# Altium schematic sheet Main schem.SchDoc
size A3
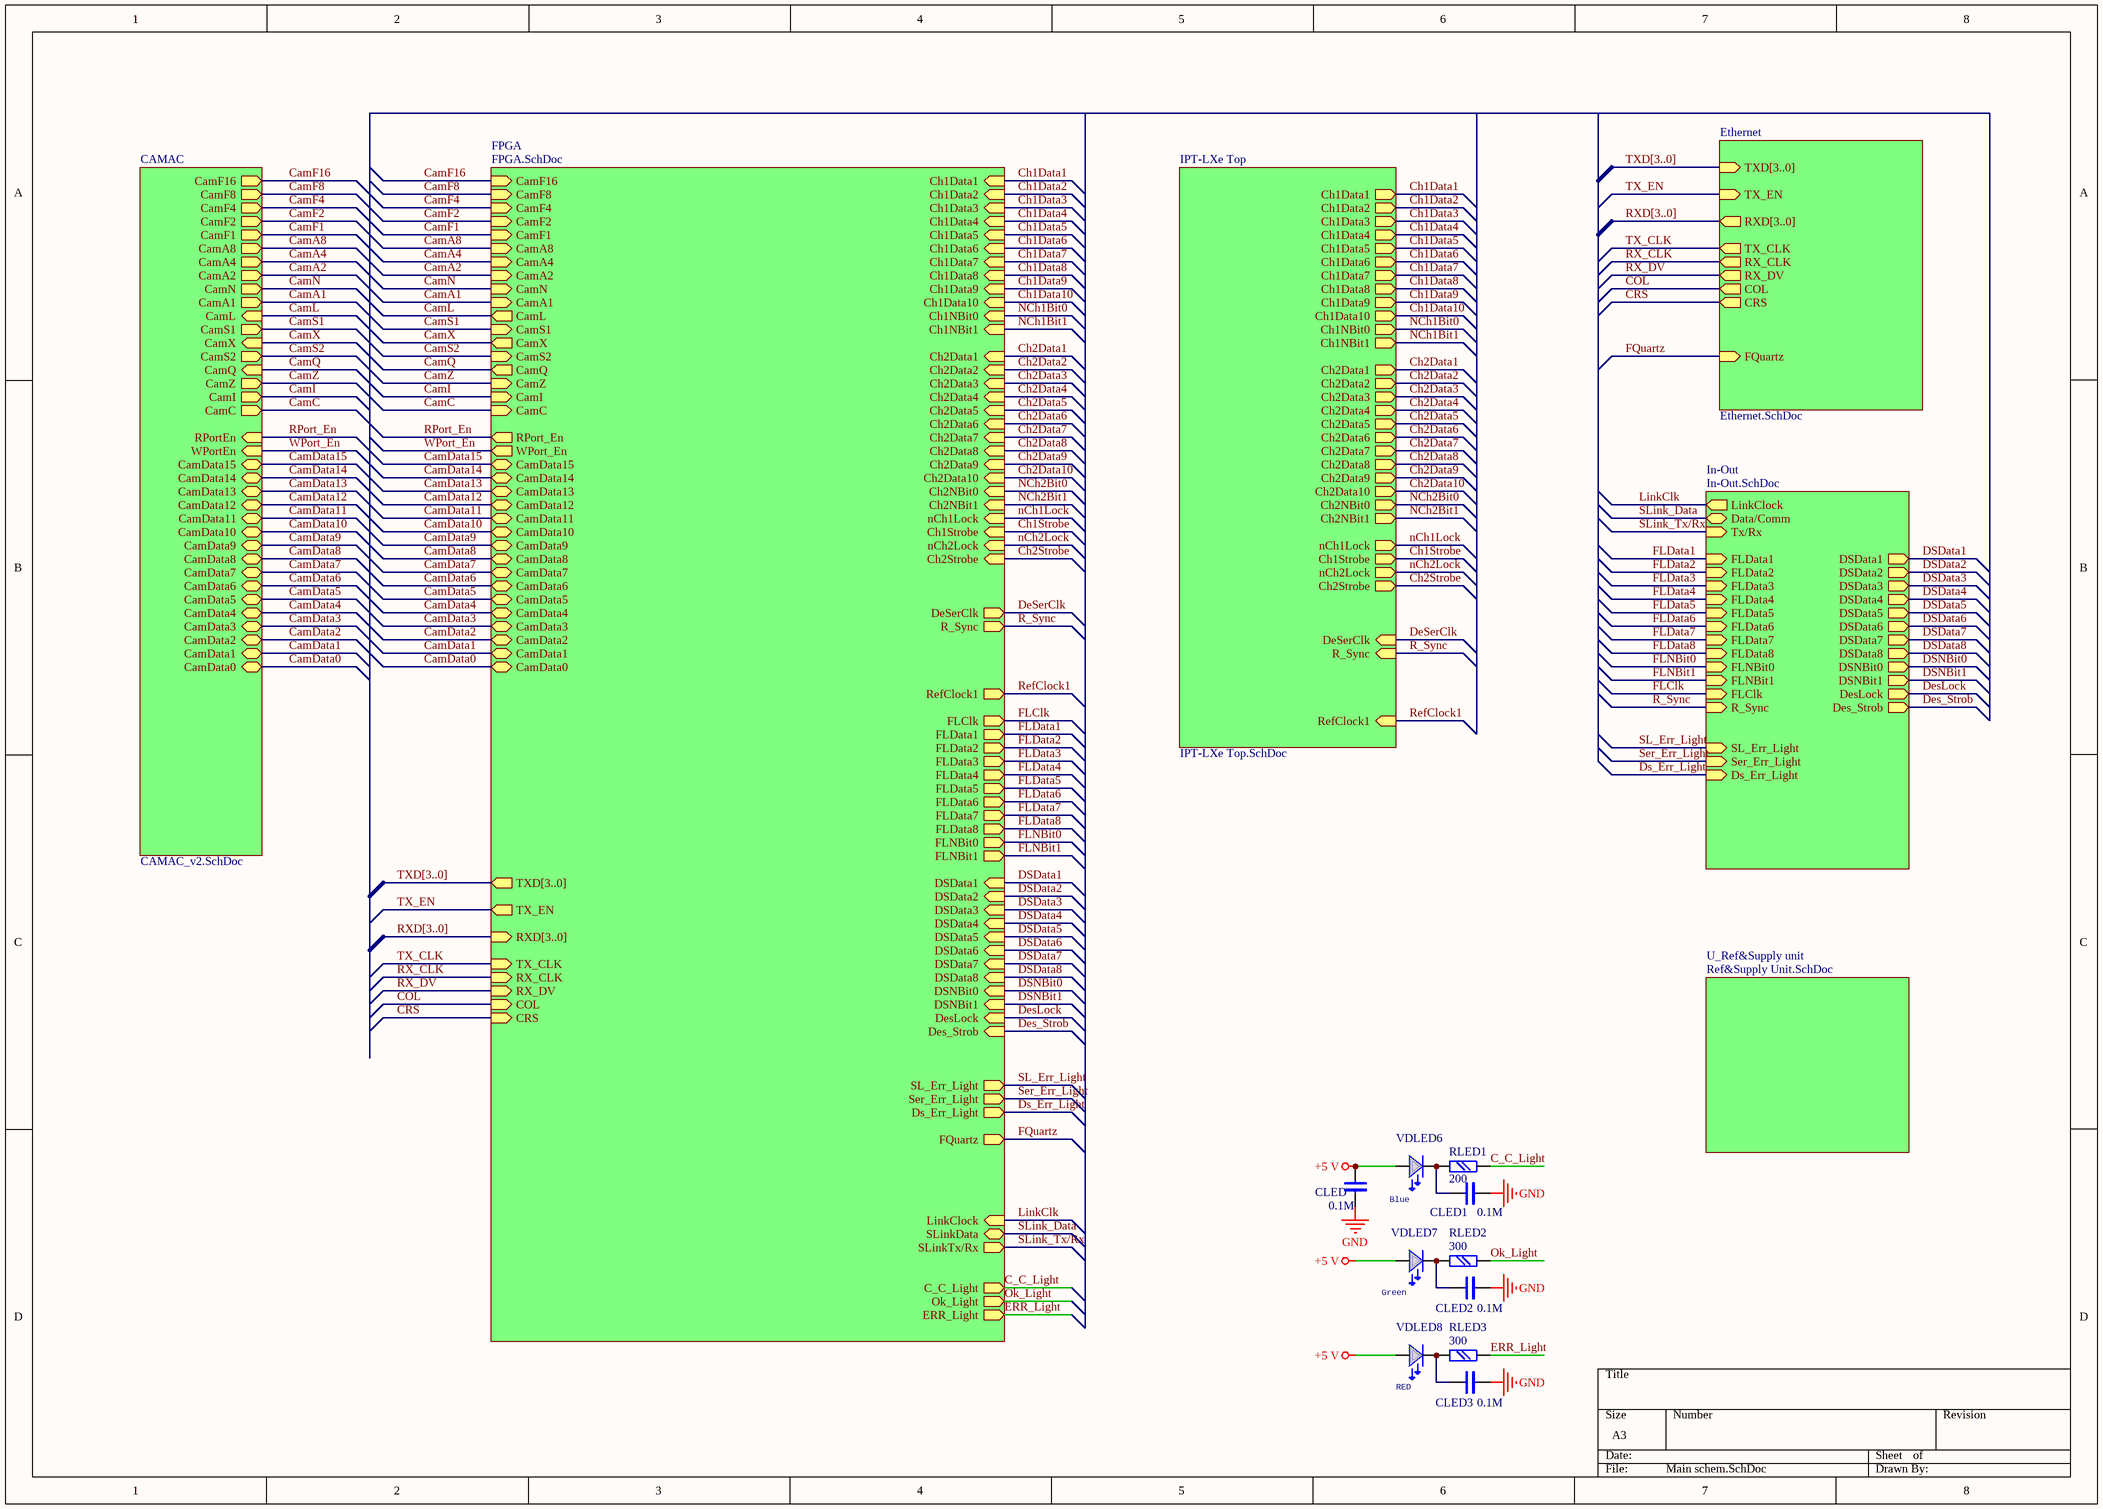
[diagram p0: Main schem.SchDoc]

## Parts
CLED  0.1M  [chip0805]
CLED1  0.1M  [chip0805]
CLED2  0.1M  [chip0805]
CLED3  0.1M  [chip0805]
RLED1  200  [chip0805]
RLED2  300  [chip0805]
RLED3  300  [chip0805]
VDLED6  LED  [LED2P5_H]  (value not drawn)
VDLED7  LED  [LED2P5_H]  (value not drawn)
VDLED8  LED  [LED2P5_H]  (value not drawn)

## Sub-sheets
CAMAC = CAMAC_v2.SchDoc: CamF1 (out), CamF2 (out), CamF4 (out), CamF8 (out), CamF16 (out), CamA8 (out), CamA4 (out), CamA2 (out), CamA1 (out), CamN (out), CamS1 (out), CamS2 (out), CamL (in), CamX (in), CamQ (in), CamData1 (bidir), CamData2 (bidir), CamData3 (bidir), CamData4 (bidir), CamData5 (bidir), CamData6 (bidir), CamData7 (bidir), CamData8 (bidir), CamData9 (bidir), CamData10 (bidir), CamData11 (bidir), CamData12 (bidir), CamData13 (bidir), CamData14 (bidir), CamData15 (bidir), CamData0 (bidir), CamI (out), CamZ (out), CamC (out), WPortEn (in), RPortEn (in)
Ethernet = Ethernet.SchDoc: COL (out), TX_EN (in), TX_CLK (out), RX_CLK (out), RX_DV (out), TXD[3..0] (in), RXD[3..0] (out), CRS (out), FQuartz (in)
FPGA = FPGA.SchDoc: ERR_Light (out), Ok_Light (out), C_C_Light (out), SLinkData (bidir), SLinkTx/Rx (out), Ch1Data1 (in), Ch1Data2 (in), Ch1Data3 (in), Ch1Data4 (in), Ch1Data5 (in), Ch1Data6 (in), Ch1Data7 (in), Ch1Data8 (in), Ch1NBit0 (in), Ch1NBit1 (in), Ch1Data9 (in), Ch1Data10 (in), LinkClock (in), CamF1 (in), CamF2 (in), CamF4 (in), CamF8 (in), CamF16 (in), CamA8 (in), CamA4 (in), CamA2 (in), CamA1 (in), CamN (in), CamS1 (in), CamS2 (in), CamL (out), CamX (out), CamQ (out), Ch2Data1 (in), Ch2Data2 (in), Ch2Data3 (in), Ch2Data4 (in), Ch2Data5 (in), Ch2Data6 (in), Ch2Data7 (in), Ch2Data8 (in), Ch2NBit0 (in), Ch2NBit1 (in), DeSerClk (out), R_Sync (out), Ch2Data9 (in), Ch2Data10 (in), nCh2Lock (in), Ch2Strobe (in), nCh1Lock (in), Ch1Strobe (in), RefClock1 (out), CamData1 (bidir), CamData2 (bidir), CamData3 (bidir), CamData4 (bidir), CamData5 (bidir), CamData6 (bidir), CamData7 (bidir), CamData8 (bidir), CamData9 (bidir), CamData10 (bidir), CamData11 (bidir), CamData12 (bidir), CamData13 (bidir), CamData14 (bidir), CamData15 (bidir), CamData0 (bidir), FLData1 (out), FLData2 (out), FLData3 (out), FLData4 (out), FLData5 (out), FLData6 (out), FLData7 (out), FLData8 (out), FLNBit0 (out), FLNBit1 (out), DSData1 (in), DSData2 (in), DSData3 (in), DSData4 (in), DSData5 (in), DSData6 (in), DSData7 (in), DSData8 (in), DSNBit0 (in), DSNBit1 (in), DesLock (in), Des_Strob (in), CamI (in), CamZ (in), CamC (in), Ser_Err_Light (out), Ds_Err_Light (out), FQuartz (out), SL_Err_Light (out), COL (in), TX_EN (out), TX_CLK (in), RX_CLK (in), RX_DV (in), TXD[3..0] (out), CRS (in), RXD[3..0] (in), WPort_En (out), RPort_En (out), FLClk (out)
In-Out = In-Out.SchDoc: Tx/Rx (in), Data/Comm (bidir), LinkClock (out), FLData1 (in), FLData2 (in), FLData3 (in), FLData4 (in), FLData5 (in), FLData6 (in), FLData7 (in), FLData8 (in), FLNBit0 (in), FLNBit1 (in), FLClk (in), R_Sync (in), DSData1 (out), DSData2 (out), DSData3 (out), DSData4 (out), DSData5 (out), DSData6 (out), DSData7 (out), DSData8 (out), DSNBit0 (out), DSNBit1 (out), DesLock (out), Des_Strob (out), Ser_Err_Light (in), Ds_Err_Light (in), SL_Err_Light (in)
IPT-LXe Top = IPT-LXe Top.SchDoc: RefClock1 (in), Ch1Data1 (out), Ch1Data2 (out), Ch1Data3 (out), Ch1Data4 (out), Ch1Data5 (out), Ch1Data6 (out), Ch1Data7 (out), Ch1Data8 (out), Ch1NBit0 (out), Ch1NBit1 (out), Ch1Data9 (out), Ch1Data10 (out), Ch2Data1 (out), Ch2Data2 (out), Ch2Data3 (out), Ch2Data4 (out), Ch2Data5 (out), Ch2Data6 (out), Ch2Data7 (out), Ch2Data8 (out), Ch2NBit0 (out), Ch2NBit1 (out), Ch2Data9 (out), Ch2Data10 (out), DeSerClk (in), R_Sync (in), nCh2Lock (out), Ch2Strobe (out), nCh1Lock (out), Ch1Strobe (out)
U_Ref&Supply unit = Ref&Supply Unit.SchDoc: no entries

## Nets
+5 V: CLED.1 VDLED6.ANOD VDLED7.ANOD VDLED8.ANOD
GND: CLED.2 CLED1.2 CLED2.2 CLED3.2
C_C_Light: RLED1.2 ; sheet FPGA/C_C_Light
CamA1: sheet CAMAC/CamA1, sheet FPGA/CamA1
CamA2: sheet CAMAC/CamA2, sheet FPGA/CamA2
CamA4: sheet CAMAC/CamA4, sheet FPGA/CamA4
CamA8: sheet CAMAC/CamA8, sheet FPGA/CamA8
CamC: sheet CAMAC/CamC, sheet FPGA/CamC
CamData0: sheet CAMAC/CamData0, sheet FPGA/CamData0
CamData1: sheet CAMAC/CamData1, sheet FPGA/CamData1
CamData2: sheet CAMAC/CamData2, sheet FPGA/CamData2
CamData3: sheet CAMAC/CamData3, sheet FPGA/CamData3
CamData4: sheet CAMAC/CamData4, sheet FPGA/CamData4
CamData5: sheet CAMAC/CamData5, sheet FPGA/CamData5
CamData6: sheet CAMAC/CamData6, sheet FPGA/CamData6
CamData7: sheet CAMAC/CamData7, sheet FPGA/CamData7
CamData8: sheet CAMAC/CamData8, sheet FPGA/CamData8
CamData9: sheet CAMAC/CamData9, sheet FPGA/CamData9
CamData10: sheet CAMAC/CamData10, sheet FPGA/CamData10
CamData11: sheet CAMAC/CamData11, sheet FPGA/CamData11
CamData12: sheet CAMAC/CamData12, sheet FPGA/CamData12
CamData13: sheet CAMAC/CamData13, sheet FPGA/CamData13
CamData14: sheet CAMAC/CamData14, sheet FPGA/CamData14
CamData15: sheet CAMAC/CamData15, sheet FPGA/CamData15
CamF1: sheet CAMAC/CamF1, sheet FPGA/CamF1
CamF2: sheet CAMAC/CamF2, sheet FPGA/CamF2
CamF4: sheet CAMAC/CamF4, sheet FPGA/CamF4
CamF8: sheet CAMAC/CamF8, sheet FPGA/CamF8
CamF16: sheet CAMAC/CamF16, sheet FPGA/CamF16
CamI: sheet CAMAC/CamI, sheet FPGA/CamI
CamL: sheet CAMAC/CamL, sheet FPGA/CamL
CamN: sheet CAMAC/CamN, sheet FPGA/CamN
CamQ: sheet CAMAC/CamQ, sheet FPGA/CamQ
CamS1: sheet CAMAC/CamS1, sheet FPGA/CamS1
CamS2: sheet CAMAC/CamS2, sheet FPGA/CamS2
CamX: sheet CAMAC/CamX, sheet FPGA/CamX
CamZ: sheet CAMAC/CamZ, sheet FPGA/CamZ
Ch1Data1: sheet IPT-LXe Top/Ch1Data1, sheet FPGA/Ch1Data1
Ch1Data2: sheet IPT-LXe Top/Ch1Data2, sheet FPGA/Ch1Data2
Ch1Data3: sheet IPT-LXe Top/Ch1Data3, sheet FPGA/Ch1Data3
Ch1Data4: sheet IPT-LXe Top/Ch1Data4, sheet FPGA/Ch1Data4
Ch1Data5: sheet IPT-LXe Top/Ch1Data5, sheet FPGA/Ch1Data5
Ch1Data6: sheet IPT-LXe Top/Ch1Data6, sheet FPGA/Ch1Data6
Ch1Data7: sheet IPT-LXe Top/Ch1Data7, sheet FPGA/Ch1Data7
Ch1Data8: sheet IPT-LXe Top/Ch1Data8, sheet FPGA/Ch1Data8
Ch1Data9: sheet IPT-LXe Top/Ch1Data9, sheet FPGA/Ch1Data9
Ch1Data10: sheet IPT-LXe Top/Ch1Data10, sheet FPGA/Ch1Data10
Ch1Strobe: sheet IPT-LXe Top/Ch1Strobe, sheet FPGA/Ch1Strobe
Ch2Data1: sheet IPT-LXe Top/Ch2Data1, sheet FPGA/Ch2Data1
Ch2Data2: sheet IPT-LXe Top/Ch2Data2, sheet FPGA/Ch2Data2
Ch2Data3: sheet IPT-LXe Top/Ch2Data3, sheet FPGA/Ch2Data3
Ch2Data4: sheet IPT-LXe Top/Ch2Data4, sheet FPGA/Ch2Data4
Ch2Data5: sheet IPT-LXe Top/Ch2Data5, sheet FPGA/Ch2Data5
Ch2Data6: sheet IPT-LXe Top/Ch2Data6, sheet FPGA/Ch2Data6
Ch2Data7: sheet IPT-LXe Top/Ch2Data7, sheet FPGA/Ch2Data7
Ch2Data8: sheet IPT-LXe Top/Ch2Data8, sheet FPGA/Ch2Data8
Ch2Data9: sheet IPT-LXe Top/Ch2Data9, sheet FPGA/Ch2Data9
Ch2Data10: sheet IPT-LXe Top/Ch2Data10, sheet FPGA/Ch2Data10
Ch2Strobe: sheet IPT-LXe Top/Ch2Strobe, sheet FPGA/Ch2Strobe
COL: sheet Ethernet/COL, sheet FPGA/COL
CRS: sheet Ethernet/CRS, sheet FPGA/CRS
Des_Strob: sheet In-Out/Des_Strob, sheet FPGA/Des_Strob
DeSerClk: sheet IPT-LXe Top/DeSerClk, sheet FPGA/DeSerClk
DesLock: sheet In-Out/DesLock, sheet FPGA/DesLock
Ds_Err_Light: sheet In-Out/Ds_Err_Light, sheet FPGA/Ds_Err_Light
DSData1: sheet In-Out/DSData1, sheet FPGA/DSData1
DSData2: sheet In-Out/DSData2, sheet FPGA/DSData2
DSData3: sheet In-Out/DSData3, sheet FPGA/DSData3
DSData4: sheet In-Out/DSData4, sheet FPGA/DSData4
DSData5: sheet In-Out/DSData5, sheet FPGA/DSData5
DSData6: sheet In-Out/DSData6, sheet FPGA/DSData6
DSData7: sheet In-Out/DSData7, sheet FPGA/DSData7
DSData8: sheet In-Out/DSData8, sheet FPGA/DSData8
DSNBit0: sheet In-Out/DSNBit0, sheet FPGA/DSNBit0
DSNBit1: sheet In-Out/DSNBit1, sheet FPGA/DSNBit1
ERR_Light: RLED3.2 ; sheet FPGA/ERR_Light
FLClk: sheet In-Out/FLClk, sheet FPGA/FLClk
FLData1: sheet In-Out/FLData1, sheet FPGA/FLData1
FLData2: sheet In-Out/FLData2, sheet FPGA/FLData2
FLData3: sheet In-Out/FLData3, sheet FPGA/FLData3
FLData4: sheet In-Out/FLData4, sheet FPGA/FLData4
FLData5: sheet In-Out/FLData5, sheet FPGA/FLData5
FLData6: sheet In-Out/FLData6, sheet FPGA/FLData6
FLData7: sheet In-Out/FLData7, sheet FPGA/FLData7
FLData8: sheet In-Out/FLData8, sheet FPGA/FLData8
FLNBit0: sheet In-Out/FLNBit0, sheet FPGA/FLNBit0
FLNBit1: sheet In-Out/FLNBit1, sheet FPGA/FLNBit1
FQuartz: sheet Ethernet/FQuartz, sheet FPGA/FQuartz
LinkClk: sheet In-Out/LinkClock, sheet FPGA/LinkClock
NCh1Bit0: sheet IPT-LXe Top/Ch1NBit0, sheet FPGA/Ch1NBit0
NCh1Bit1: sheet IPT-LXe Top/Ch1NBit1, sheet FPGA/Ch1NBit1
nCh1Lock: sheet IPT-LXe Top/nCh1Lock, sheet FPGA/nCh1Lock
NCh2Bit0: sheet IPT-LXe Top/Ch2NBit0, sheet FPGA/Ch2NBit0
NCh2Bit1: sheet IPT-LXe Top/Ch2NBit1, sheet FPGA/Ch2NBit1
nCh2Lock: sheet IPT-LXe Top/nCh2Lock, sheet FPGA/nCh2Lock
Ok_Light: RLED2.2 ; sheet FPGA/Ok_Light
R_Sync: sheet In-Out/R_Sync, sheet IPT-LXe Top/R_Sync, sheet FPGA/R_Sync
RefClock1: sheet IPT-LXe Top/RefClock1, sheet FPGA/RefClock1
RPort_En: sheet CAMAC/RPortEn, sheet FPGA/RPort_En
RX_CLK: sheet Ethernet/RX_CLK, sheet FPGA/RX_CLK
RX_DV: sheet Ethernet/RX_DV, sheet FPGA/RX_DV
Ser_Err_Light: sheet In-Out/Ser_Err_Light, sheet FPGA/Ser_Err_Light
SL_Err_Light: sheet In-Out/SL_Err_Light, sheet FPGA/SL_Err_Light
SLink_Data: sheet In-Out/Data/Comm, sheet FPGA/SLinkData
SLink_Tx/Rx: sheet In-Out/Tx/Rx, sheet FPGA/SLinkTx/Rx
TX_CLK: sheet Ethernet/TX_CLK, sheet FPGA/TX_CLK
TX_EN: sheet Ethernet/TX_EN, sheet FPGA/TX_EN
WPort_En: sheet CAMAC/WPortEn, sheet FPGA/WPort_En
NetCLED1_1: CLED1.1 RLED1.1 VDLED6.CATH
NetCLED2_1: CLED2.1 RLED2.1 VDLED7.CATH
NetCLED3_1: CLED3.1 RLED3.1 VDLED8.CATH

## Buses and harness runs
bus RXD[3..0] = sheet Ethernet/RXD[3..0]
bus RXD[3..0] = sheet FPGA/RXD[3..0]
bus TXD[3..0] = sheet Ethernet/TXD[3..0]
bus TXD[3..0] = sheet FPGA/TXD[3..0]

## Notes on the sheet
- Blue
- (near VDLED7) Green
- (near VDLED8) RED

## Library data of the parts
CLED CLED1-CLED3 = C: Text Field1: 20; Text Field2: 10
RLED1-RLED3 = R: Text Field1: 20; Text Field2: 20
VDLED6-VDLED8 = AL307: Text Field1: 10; Text Field2: 30